# Altium schematic sheet Power_bouton.SchDoc
size A4
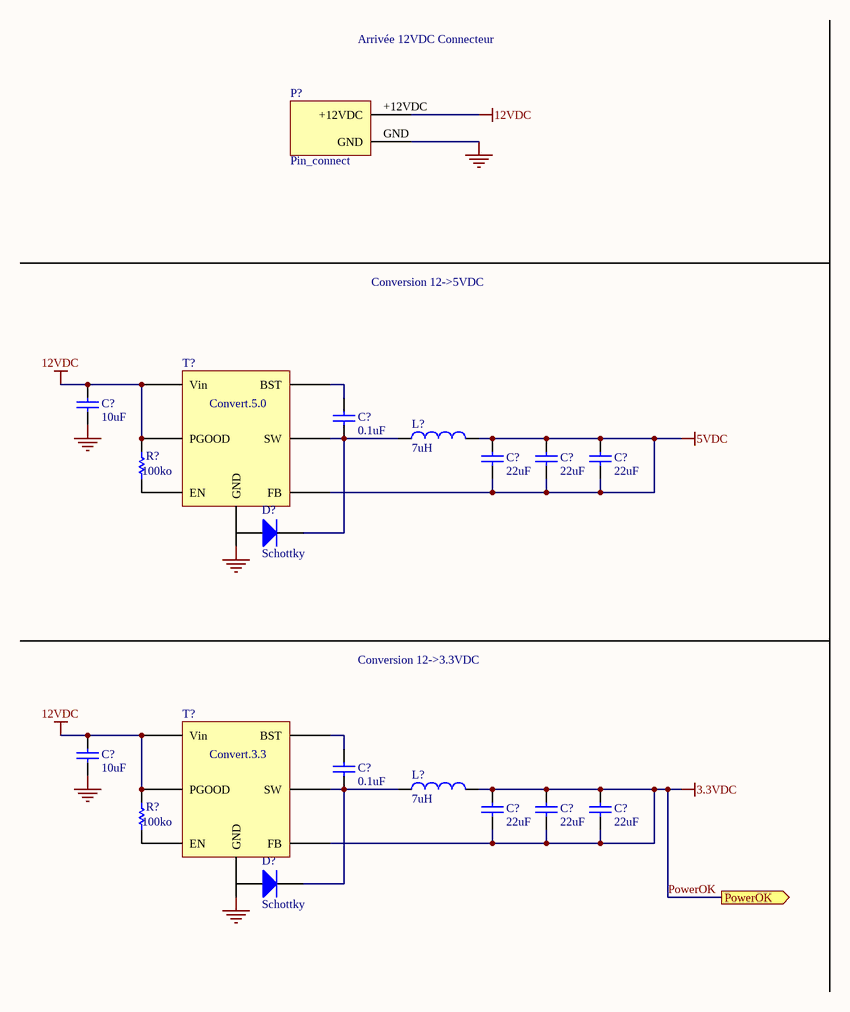
[diagram p0: Power_bouton.SchDoc]

## Parts
(Parts that share a designator on the sheet are numbered #1, #2 ... from top to bottom, then left to right.)
C?#1  10uF  [RAD-0.3]
C?#2  0.1uF  [RAD-0.3]
C?#3  22uF  [RAD-0.3]
C?#4  22uF  [RAD-0.3]
C?#5  22uF  [RAD-0.3]
C?#6  10uF  [RAD-0.3]
C?#7  0.1uF  [RAD-0.3]
C?#8  22uF  [RAD-0.3]
C?#9  22uF  [RAD-0.3]
C?#10  22uF  [RAD-0.3]
D?#1  Schottky  [SMC]
D?#2  Schottky  [SMC]
L?#1  7uH  [0402-A]
L?#2  7uH  [0402-A]
P?  Pin_connect
R?#1  100ko  [AXIAL-0.3]
R?#2  100ko  [AXIAL-0.3]
T?#1  Convert.5.0
T?#2  Convert.3.3

## Ports
PowerOK (out)

## Nets
5VDC: C?#3.1 C?#3.2 C?#4.1 C?#4.2 C?#5.1 C?#5.2 L?#1.2 T?#1.FB
12VDC: C?#1.1 C?#6.1 P?.+12VDC R?#1.2 R?#2.2 T?#1.PGOOD T?#1.Vin T?#2.PGOOD T?#2.Vin
GND: C?#1.2 C?#6.2 P?.GND T?#1.GND T?#2.GND
PowerOK: C?#8.1 C?#8.2 C?#9.1 C?#9.2 C?#10.1 C?#10.2 L?#2.2 T?#2.FB ; port PowerOK  [also labelled 3.3VDC]
NetC?#2_1: C?#2.1 T?#1.BST
NetC?#2_2: C?#2.2 D?#1.2(K) L?#1.1 T?#1.SW
NetC?#7_1: C?#7.1 T?#2.BST
NetC?#7_2: C?#7.2 D?#2.2(K) L?#2.1 T?#2.SW
NetR?#1_1: R?#1.1 T?#1.EN
NetR?#2_1: R?#2.1 T?#2.EN

Not connected (* = marked no-connect by the designer): D?#1 1(A); D?#2 1(A)

## Notes on the sheet
- Arrivée 12VDC Connecteur
- Conversion 12->5VDC
- Conversion 12->3.3VDC

## Library data of the parts
C?#1 = Cap: Cin_Reg_5v; Fournisseur: Farnell; Fabricant: KEMET; Ref.Fabricant: C0603C106M9PACTU; Ref.Fournisseur: 1288201; Value: 10uF
C?#2 = Cap: Cbst_Reg_5v; Fournisseur: Farnell; Fabricant: TDK; Ref.Fabricant: CGA2B3X7R1E104K050BB; Ref.Fournisseur: 2210820; Value: 0.1uF
C?#3-C?#5 = Cap: Cout_Reg_5v; Fournisseur: Farnell; Fabricant: AVX; Ref.Fabricant: 12103D226KAT2A; Ref.Fournisseur: 1833829; Value: 22uF
C?#6 = Cap: Cin_Reg_3.3v; Fournisseur: Farnell; Fabricant: KEMET; Ref.Fabricant: C0603C106M9PACTU; Ref.Fournisseur: 1288201; Value: 10uF
C?#7 = Cap: Cbst_Reg_3.3v; Fournisseur: Farnell; Fabricant: TDK; Ref.Fabricant: CGA2B3X7R1E104K050BB; Ref.Fournisseur: 2210820; Value: 0.1uF
C?#8-C?#10 = Cap: Cout_Reg_3.3v; Fournisseur: Farnell; Fabricant: AVX; Ref.Fabricant: 12103D226KAT2A; Ref.Fournisseur: 1833829; Value: 22uF
D?#1 D?#2 = Diode: D_Conv_5v; Fournisseur: Farnell; Ref.Fournisseur: 1459078; Fabricant: OnSemiconductor; Ref.Fabricant: MBRS330T3G
L?#1 = Inductor: L_Reg_5v; Fabricant: Coilcraft; Ref.Fabricant: MSS1038-702NLC; Fournisseur: Farnell; Ref.Fournisseur: 2288224; Value: 7uH
L?#2 = Inductor: L_Reg_3.3v; Fabricant: Coilcraft; Ref.Fabricant: MSS1038-702NLC; Fournisseur: Farnell; Ref.Fournisseur: 2288224; Value: 7uH
P? = FC68148S: Fournisseur: Farnell; Ref.Fournisseur: 1888309; Fabricant: CLIFF; Ref.Fabricant: FC68148S
R?#1 = Res1: R_PGOOD_REG_5v; Ref.Fabricant: MCWR06X1003FTL; Fournisseur: Farnell; Ref.Fournisseur: 2447226; Fabricant: Multicomp; Value: 100ko
R?#2 = Res1: R_PGOOD_REG_3.3v; Ref.Fabricant: MCWR06X1003FTL; Fournisseur: Farnell; Ref.Fournisseur: 2447226; Fabricant: Multicomp; Value: 100ko
T?#1 = ADP2302ARDZ-5.0-R7: Fournisseur: Farnell; Ref.Fournisseur: 2727507; Fabricant: Analog Devices; Ref.Fabricant: ADP2302ARDZ-5.0-R7
T?#2 = ADP2302ARDZ-3.3-R7: Fournisseur: Farnell; Ref.Fournisseur: 2376914; Fabricant: Analog Devices; Ref.Fabricant: ADP2302ARDZ-3.3-R7